# Altium schematic sheet Tag_Schematic.SchDoc
size A4
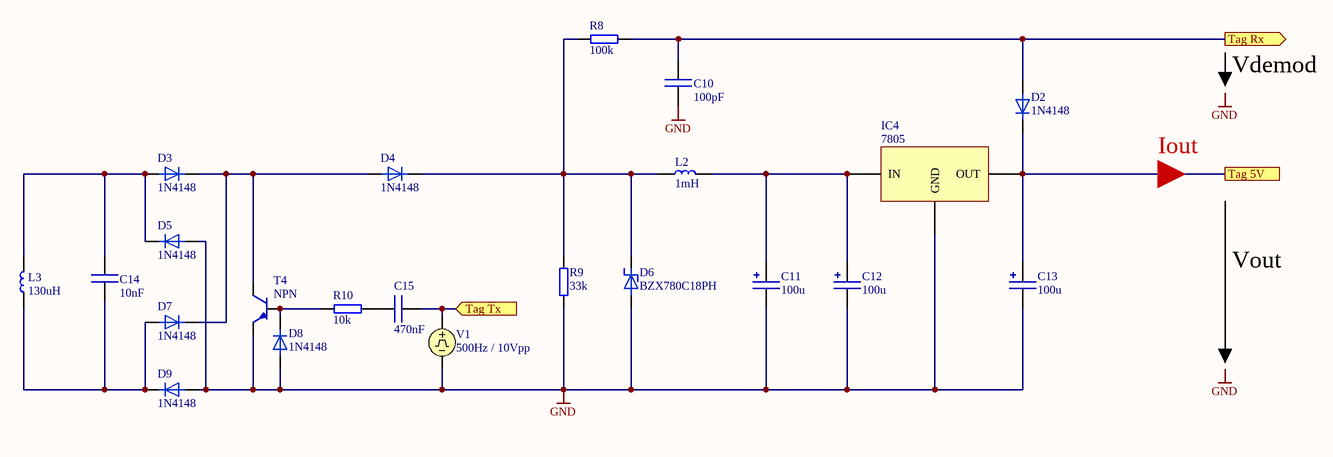
[diagram p0: Tag_Schematic.SchDoc]

## Parts
C10  100pF  [0805]
C11  100u  [ELKO_10_5.0]
C12  100u  [ELKO_10_5.0]
C13  100u  [ELKO_10_5.0]
C14  10nF  [0805]
C15  470nF  [0805]
D2  1N4148
D3  1N4148
D4  1N4148
D5  1N4148
D6  BZX780C18PH
D7  1N4148
D8  1N4148
D9  1N4148
IC4  7805
L2  1mH
L3  130uH
R8  100k  [Axial-04]
R9  33k  [Axial-04]
R10  10k  [Axial-04]
T4  NPN  [2SC3324]
V1  500Hz / 10Vpp

## Ports
Tag 5V, Tag Rx (out), Tag Tx (in)

## Nets
GND: C10.1 C11.2 C12.2 C13.2 D5.1(Anode) D6.1(Anode) D8.1(Anode) D9.1(Anode) IC4.3(GND) R9.1 T4.2(Emitter) V1.2
Tag 5V: C13.1 D2.2(Kathode) IC4.2(OUT) ; port Tag 5V
Tag Rx: C10.2 D2.1(Anode) R8.2 ; port Tag Rx
Tag Tx: C15.2 V1.1 ; port Tag Tx
NetC11_1: C11.1 C12.1 IC4.1(IN) L2.1
NetC14_1: C14.1 D7.1(Anode) D9.2(Kathode) L3.2
NetC14_2: C14.2 D3.1(Anode) D5.2(Kathode) L3.1
NetC15_1: C15.1 R10.2
NetD3_2: D3.2(Kathode) D4.1(Anode) D7.2(Kathode) T4.3(Collector)
NetD4_2: D4.2(Kathode) D6.2(Kathode) L2.2 R8.1 R9.2
NetD8_2: D8.2(Kathode) R10.1 T4.1(Base)

## Notes on the sheet
- Vdemod
- Iout
- Vout
- Labels drawn without touching a wire or pin: GND
- Title
- Size:
- Date:
- A4
- Number:
- Time:
- Revision:
- Sheet
- of
- File:

## Library data of the parts
C10 C14 C15 = Cap
  C10: VALUE: 100pF
  C14: VALUE: 10nF
  C15: VALUE: 470nF
C11-C13 = Elko: VALUE: 100u
D2-D5 D7-D9 = Diode
D6 = Z-Diode
IC4 = 7805: 5V Voltage regulator
L2 L3 = Inductor
  L2: Value: 1mH
  L3: Value: 130uH
R8-R10 = Res
  R8: Value: 100k
  R9: Value: 33k
  R10: Value: 10k
V1 = VPULSE: Pulse Voltage Source; Note: PCB Footprint - Not required; Published: 8-Jun-2000; LatestRevisionDate: 15-Nov-2004; LatestRevisionNote: Corrected Netlist.; PackageReference: Not Applicable; Publisher: Altium Limited